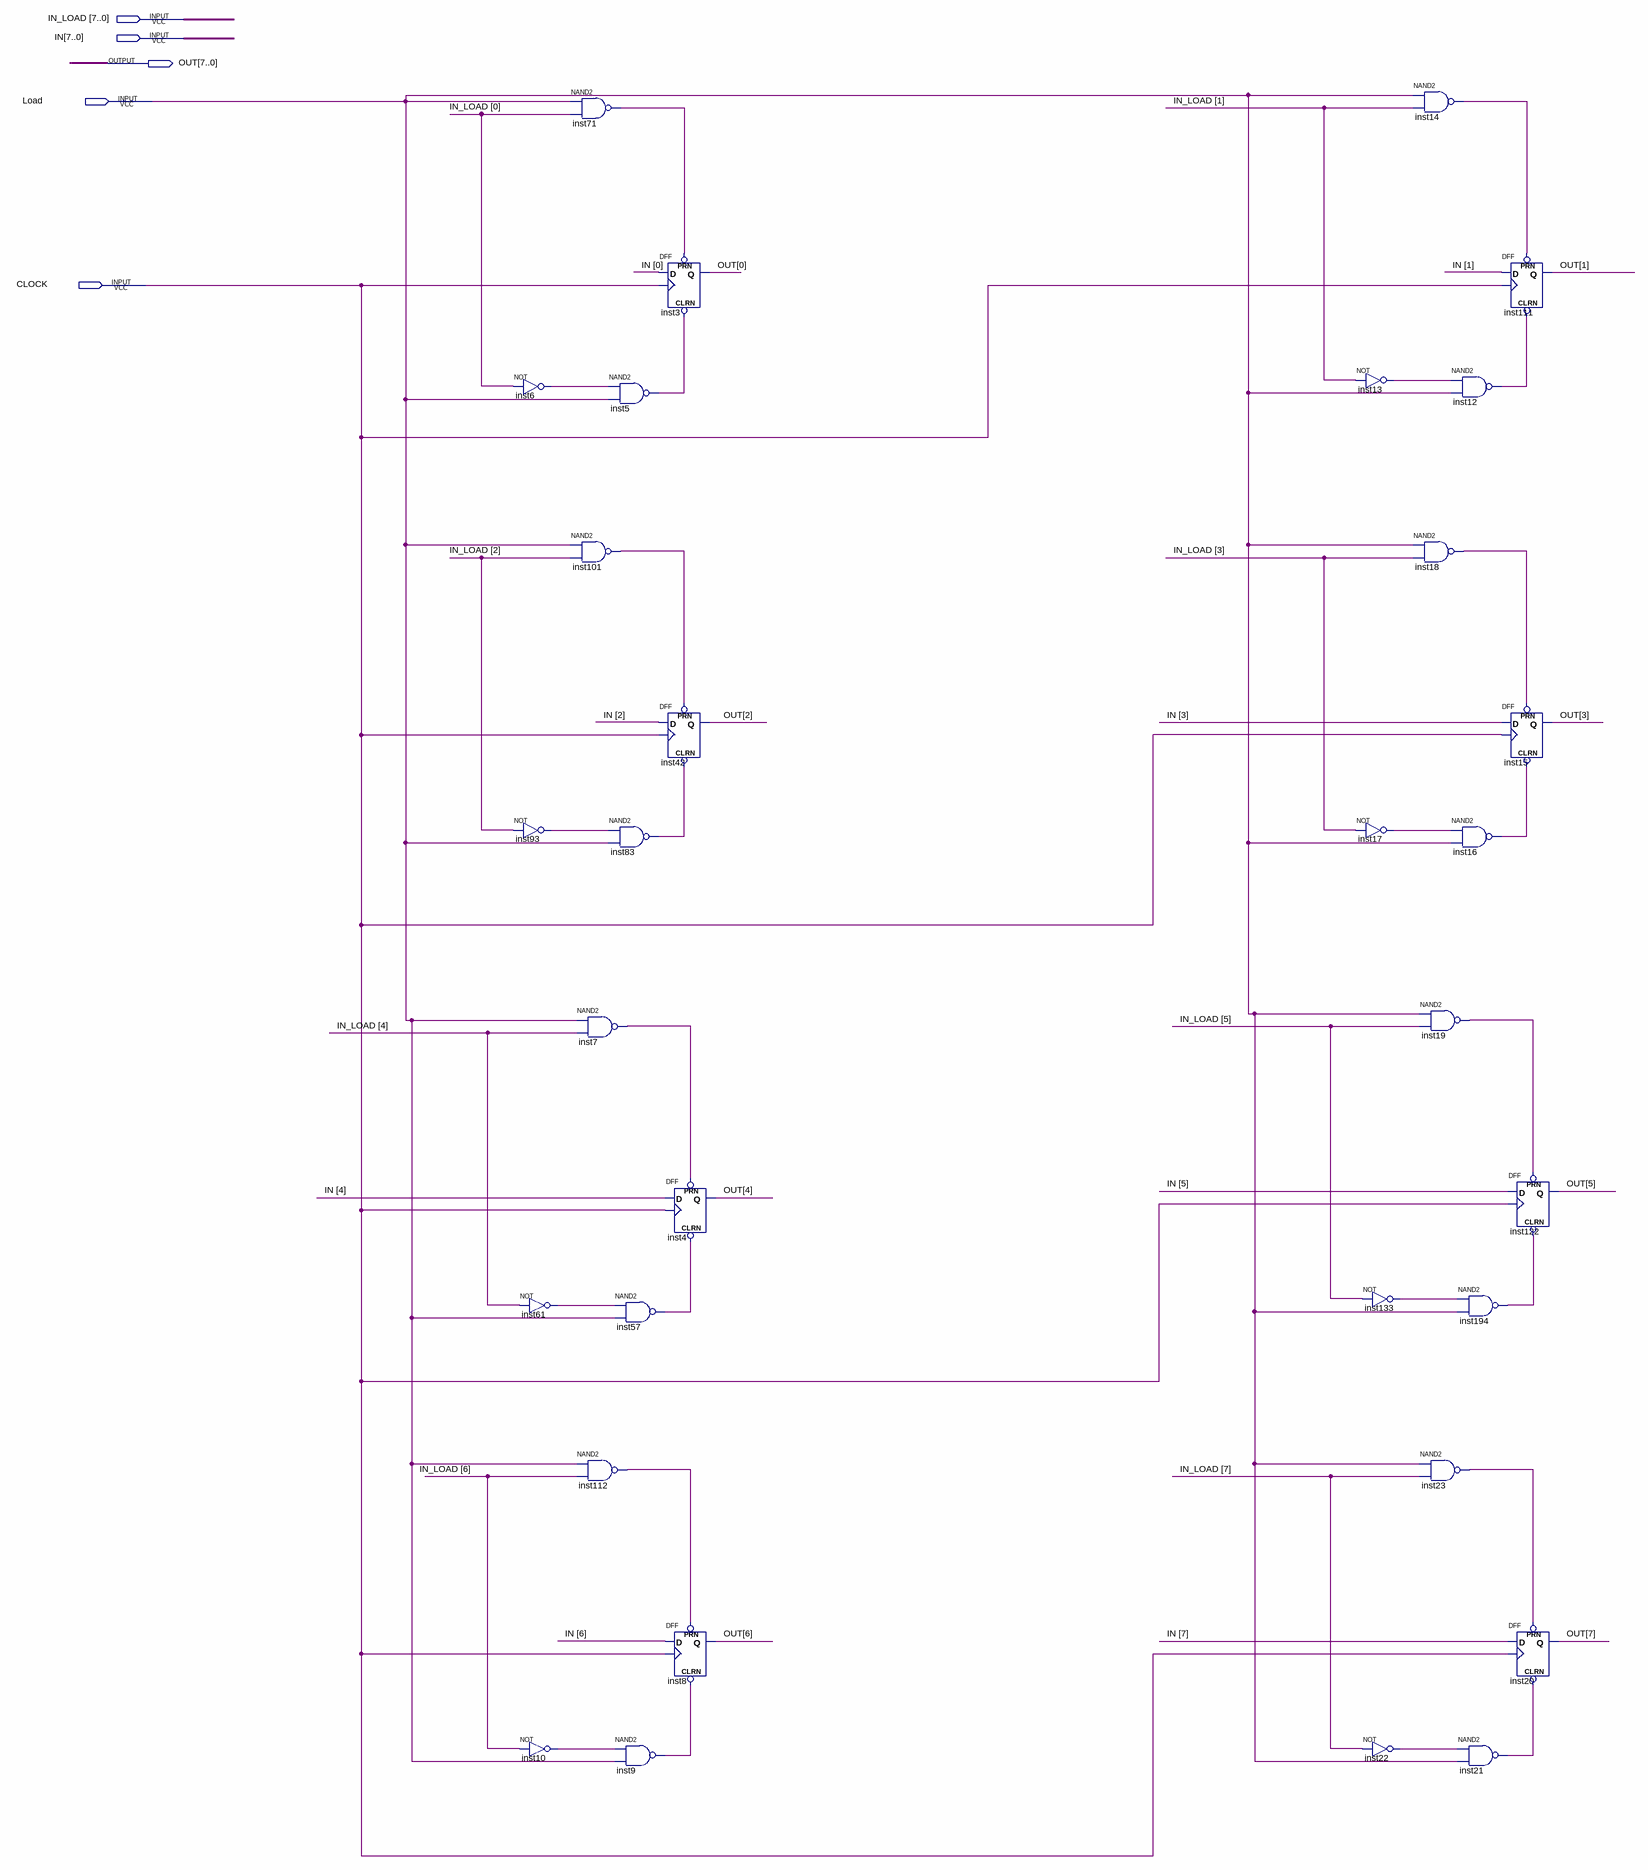
[diagram p0: schematic sheet]
// Quartus schematic REGISTER.bdf as structural Verilog: 32 symbols, 5 pins
module REGISTER (
  input  [7:0] IN_LOAD,
  input  [7:0] IN,
  input  Load,
  input  CLOCK,
  output [7:0] OUT
);

  wire inst5_out, inst6_out, inst7_out, inst9_out, inst10_out, inst12_out, inst13_out, inst14_out,
       inst16_out, inst17_out, inst18_out, inst19_out, inst21_out, inst22_out, inst23_out, inst57_out,
       inst61_out, inst71_out, inst83_out, inst93_out, inst101_out, inst112_out, inst133_out, inst194_out;

  not inst6 (inst6_out, IN_LOAD[0]);
  not inst93 (inst93_out, IN_LOAD[2]);
  not inst61 (inst61_out, IN_LOAD[4]);
  not inst10 (inst10_out, IN_LOAD[6]);
  nand inst71 (inst71_out, Load, IN_LOAD[0]);
  nand inst101 (inst101_out, Load, IN_LOAD[2]);
  nand inst7 (inst7_out, Load, IN_LOAD[4]);
  nand inst112 (inst112_out, Load, IN_LOAD[6]);
  nand inst5 (inst5_out, inst6_out, Load);
  nand inst83 (inst83_out, inst93_out, Load);
  nand inst57 (inst57_out, inst61_out, Load);
  nand inst9 (inst9_out, inst10_out, Load);
  DFF inst3 (.CLRN(inst5_out), .CLK(CLOCK), .D(IN[0]), .PRN(inst71_out), .Q(OUT[0]));
  DFF inst42 (.CLRN(inst83_out), .CLK(CLOCK), .D(IN[2]), .PRN(inst101_out), .Q(OUT[2]));
  DFF inst4 (.CLRN(inst57_out), .CLK(CLOCK), .D(IN[4]), .PRN(inst7_out), .Q(OUT[4]));
  DFF inst8 (.CLRN(inst9_out), .CLK(CLOCK), .D(IN[6]), .PRN(inst112_out), .Q(OUT[6]));
  not inst13 (inst13_out, IN_LOAD[1]);
  not inst17 (inst17_out, IN_LOAD[3]);
  not inst133 (inst133_out, IN_LOAD[5]);
  not inst22 (inst22_out, IN_LOAD[7]);
  nand inst14 (inst14_out, Load, IN_LOAD[1]);
  nand inst18 (inst18_out, Load, IN_LOAD[3]);
  nand inst19 (inst19_out, Load, IN_LOAD[5]);
  nand inst23 (inst23_out, Load, IN_LOAD[7]);
  nand inst12 (inst12_out, inst13_out, Load);
  nand inst16 (inst16_out, inst17_out, Load);
  nand inst194 (inst194_out, inst133_out, Load);
  nand inst21 (inst21_out, inst22_out, Load);
  DFF inst111 (.CLRN(inst12_out), .CLK(CLOCK), .D(IN[1]), .PRN(inst14_out), .Q(OUT[1]));
  DFF inst15 (.CLRN(inst16_out), .CLK(CLOCK), .D(IN[3]), .PRN(inst18_out), .Q(OUT[3]));
  DFF inst122 (.CLRN(inst194_out), .CLK(CLOCK), .D(IN[5]), .PRN(inst19_out), .Q(OUT[5]));
  DFF inst20 (.CLRN(inst21_out), .CLK(CLOCK), .D(IN[7]), .PRN(inst23_out), .Q(OUT[7]));
endmodule
